# Altium project REG.PrjPcb (part 2 of 2)

## Sheet ALU_Shifter.SchDoc
size B; Author: E. Sims; Organization: Let's Build Rockets Inc.; SheetNumber: 15; SheetTotal: 16
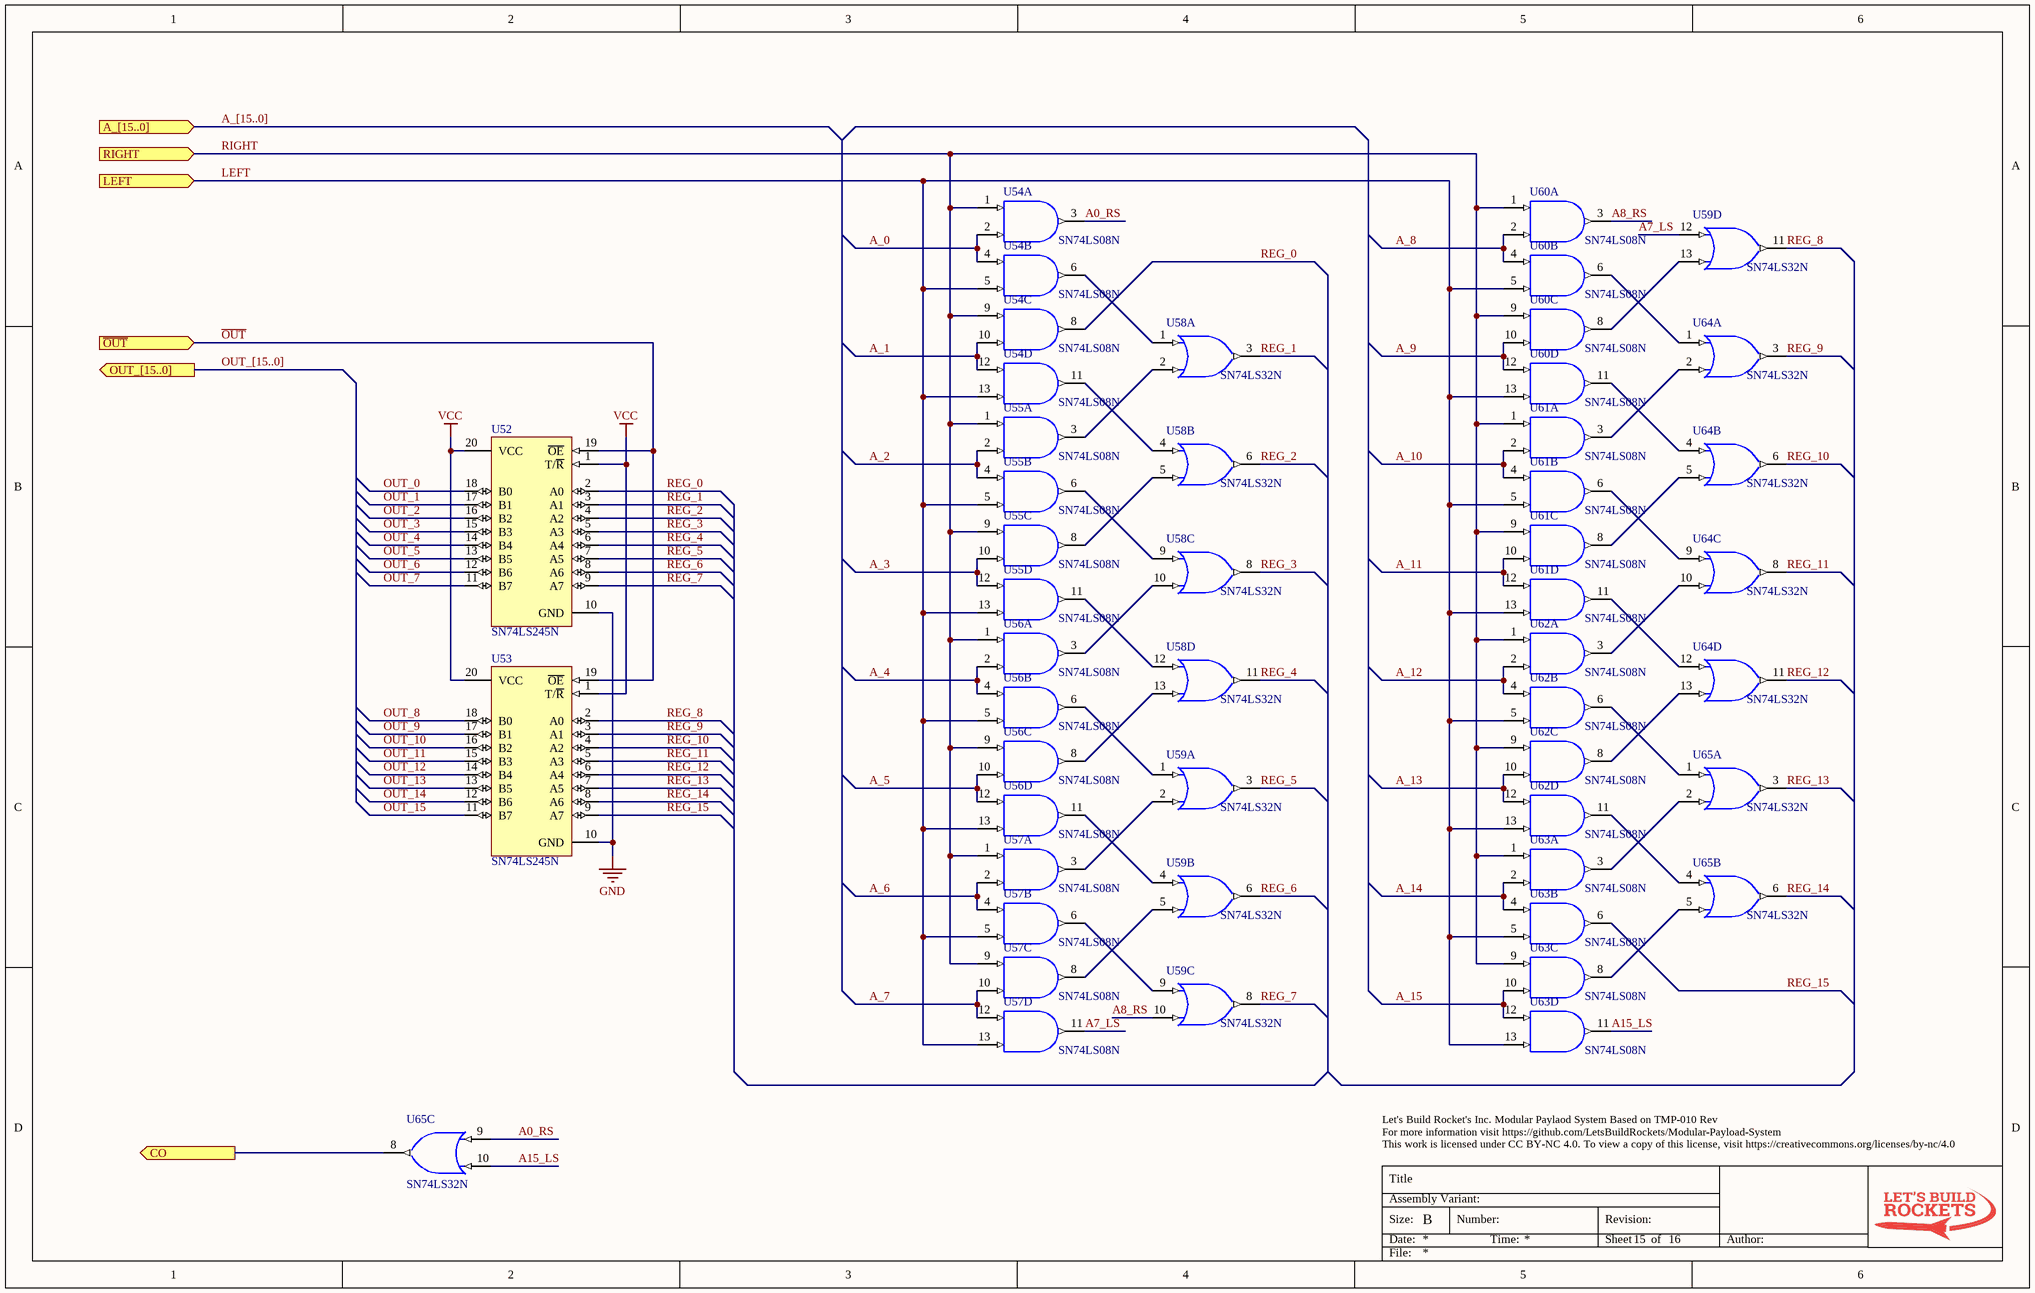
[diagram p11: ALU_Shifter.SchDoc]

### Parts
U52  SN74LS245N  [N020]
U53  SN74LS245N  [N020]
U54  SN74LS08N  [N014]  (parts A,B,C,D of 4)
U55  SN74LS08N  [N014]  (parts A,B,C,D of 4)
U56  SN74LS08N  [N014]  (parts A,B,C,D of 4)
U57  SN74LS08N  [N014]  (parts A,B,C,D of 4)
U58  SN74LS32N  [N014]  (parts A,B,C,D of 4)
U59  SN74LS32N  [N014]  (parts A,B,C,D of 4)
U60  SN74LS08N  [N014]  (parts A,B,C,D of 4)
U61  SN74LS08N  [N014]  (parts A,B,C,D of 4)
U62  SN74LS08N  [N014]  (parts A,B,C,D of 4)
U63  SN74LS08N  [N014]  (parts A,B,C,D of 4)
U64  SN74LS32N  [N014]  (parts A,B,C,D of 4)
U65  SN74LS32N  [N014]  (parts A,B,C of 4)

### Ports
A_[15..0] (in), CO (out), LEFT (in), OUT_[15..0] (out), RIGHT (in), ~{OUT} (in)

### Nets
GND: U52.10(GND) U53.10(GND) U54.7(GND) U55.7(GND) U56.7(GND) U57.7(GND) U58.7(GND) U59.7(GND) U60.7(GND) U61.7(GND) U62.7(GND) U63.7(GND) U64.7(GND) U65.7(GND)
VCC: U52.1(T/~{R}) U52.20(VCC) U53.1(T/~{R}) U53.20(VCC) U54.14(VCC) U55.14(VCC) U56.14(VCC) U57.14(VCC) U58.14(VCC) U59.14(VCC) U60.14(VCC) U61.14(VCC) U62.14(VCC) U63.14(VCC) U64.14(VCC) U65.14(VCC)
A0_RS: U54.3(Y) U65.9(A)
A7_LS: U57.11(Y) U59.12(A)
A8_RS: U59.10(B) U60.3(Y)
A15_LS: U63.11(Y) U65.10(B)
A_0: U54.2(B) U54.4(A)
A_1: U54.10(B) U54.12(A)
A_2: U55.2(B) U55.4(A)
A_3: U55.10(B) U55.12(A)
A_4: U56.2(B) U56.4(A)
A_5: U56.10(B) U56.12(A)
A_6: U57.2(B) U57.4(A)
A_7: U57.10(B) U57.12(A)
A_8: U60.2(B) U60.4(A)
A_9: U60.10(B) U60.12(A)
A_10: U61.2(B) U61.4(A)
A_11: U61.10(B) U61.12(A)
A_12: U62.2(B) U62.4(A)
A_13: U62.10(B) U62.12(A)
A_14: U63.2(B) U63.4(A)
A_15: U63.10(B) U63.12(A)
LEFT: U54.5(B) U54.13(B) U55.5(B) U55.13(B) U56.5(B) U56.13(B) U57.5(B) U57.13(B) U60.5(B) U60.13(B) U61.5(B) U61.13(B) U62.5(B) U62.13(B) U63.5(B) U63.13(B) ; port LEFT
~{OUT}: U52.19(~{OE}) U53.19(~{OE}) ; port ~{OUT}
OUT_0: U52.18(B0)  [project net BUS_0]
OUT_1: U52.17(B1)  [project net BUS_1]
OUT_2: U52.16(B2)  [project net BUS_2]
OUT_3: U52.15(B3)  [project net BUS_3]
OUT_4: U52.14(B4)  [project net BUS_4]
OUT_5: U52.13(B5)  [project net BUS_5]
OUT_6: U52.12(B6)  [project net BUS_6]
OUT_7: U52.11(B7)  [project net BUS_7]
OUT_8: U53.18(B0)  [project net BUS_8]
OUT_9: U53.17(B1)  [project net BUS_9]
OUT_10: U53.16(B2)  [project net BUS_10]
OUT_11: U53.15(B3)  [project net BUS_11]
OUT_12: U53.14(B4)  [project net BUS_12]
OUT_13: U53.13(B5)  [project net BUS_13]
OUT_14: U53.12(B6)  [project net BUS_14]
OUT_15: U53.11(B7)  [project net BUS_15]
REG_0: U52.2(A0) U54.8(Y)
REG_1: U52.3(A1) U58.3(Y)
REG_2: U52.4(A2) U58.6(Y)
REG_3: U52.5(A3) U58.8(Y)
REG_4: U52.6(A4) U58.11(Y)
REG_5: U52.7(A5) U59.3(Y)
REG_6: U52.8(A6) U59.6(Y)
REG_7: U52.9(A7) U59.8(Y)
REG_8: U53.2(A0) U59.11(Y)
REG_9: U53.3(A1) U64.3(Y)
REG_10: U53.4(A2) U64.6(Y)
REG_11: U53.5(A3) U64.8(Y)
REG_12: U53.6(A4) U64.11(Y)
REG_13: U53.7(A5) U65.3(Y)
REG_14: U53.8(A6) U65.6(Y)
REG_15: U53.9(A7) U63.6(Y)
RIGHT: U54.1(A) U54.9(A) U55.1(A) U55.9(A) U56.1(A) U56.9(A) U57.1(A) U57.9(A) U60.1(A) U60.9(A) U61.1(A) U61.9(A) U62.1(A) U62.9(A) U63.1(A) U63.9(A) ; port RIGHT
NetU54_6: U54.6(Y) U58.1(A)
NetU54_11: U54.11(Y) U58.4(A)
NetU55_3: U55.3(Y) U58.2(B)
NetU55_6: U55.6(Y) U58.9(A)
NetU55_8: U55.8(Y) U58.5(B)
NetU55_11: U55.11(Y) U58.12(A)
NetU56_3: U56.3(Y) U58.10(B)
NetU56_6: U56.6(Y) U59.1(A)
NetU56_8: U56.8(Y) U58.13(B)
NetU56_11: U56.11(Y) U59.4(A)
NetU57_3: U57.3(Y) U59.2(B)
NetU57_6: U57.6(Y) U59.9(A)
NetU57_8: U57.8(Y) U59.5(B)
NetU59_13: U59.13(B) U60.8(Y)
NetU60_6: U60.6(Y) U64.1(A)
NetU60_11: U60.11(Y) U64.4(A)
NetU61_3: U61.3(Y) U64.2(B)
NetU61_6: U61.6(Y) U64.9(A)
NetU61_8: U61.8(Y) U64.5(B)
NetU61_11: U61.11(Y) U64.12(A)
NetU62_3: U62.3(Y) U64.10(B)
NetU62_6: U62.6(Y) U65.1(A)
NetU62_8: U62.8(Y) U64.13(B)
NetU62_11: U62.11(Y) U65.4(A)
NetU63_3: U63.3(Y) U65.2(B)
NetU63_8: U63.8(Y) U65.5(B)
NetU65_8: U65.8(Y) ; port CO

### Buses and harness runs
bus A_[15..0] = port A_[15..0]
bus OUT_[15..0] = port OUT_[15..0]

### Notes on the sheet
- Let's Build Rocket's Inc. Modular Paylaod System Based on TMP-010 Rev
  For more information visit https://github.com/LetsBuildRockets/Modular-Payload-System
  This work is licensed under CC BY-NC 4.0. To view a copy of this license, visit https://creativecommons.org/licenses/by-nc/4.0
- Title
- Size:
- Date:
- Assembly Variant:
- B
- Number:
- Time:
- Revision:
- Sheet
- of
- Author:
- File:

### Library data of the parts
U52 U53 = SN74LS245N: Octal Bus Transceiver with 3-State Outputs; Published: 8-Jun-2000; LatestRevisionDate: 04-Mar-2005; LatestRevisionNote: Stylized 3D Model Added.; DatasheetVersion: Mar-1988; PackageVersion: Oct-1995; PackageReference: N020; Publisher: Altium Limited; PackageDescription: DIP; 20 Leads; Row Spacing 7.62 mm; Pitch 2.54 mm; ComponentLink1Description: Manufacturer Link; ComponentLink1URL: http://www.ti.com/; ComponentLink2Description: Datasheet; ComponentLink2URL: http://www-s.ti.com/sc/ds/sn74ls245.pdf
U54-U57 U60-U63 = SN74LS08N: Quadruple 2-Input Positive-AND Gate; Published: 8-Jun-2000; LatestRevisionDate: 04-Mar-2005; LatestRevisionNote: Stylized 3D Model Added.; DatasheetVersion: Mar-1988; PackageVersion: Oct-1995; PackageReference: N014; Publisher: Altium Limited; PackageDescription: DIP; 14 Leads; Row Spacing 7.62 mm; Pitch 2.54 mm; ComponentLink1Description: Manufacturer Link; ComponentLink1URL: http://www.ti.com/; ComponentLink2Description: Datasheet; ComponentLink2URL: http://www-s.ti.com/sc/ds/SN74LS08.pdf
U58 U59 U64 U65 = SN74LS32N: Quadruple 2-Input Positive-OR Gate; Published: 8-Jun-2000; LatestRevisionDate: 04-Mar-2005; LatestRevisionNote: Stylized 3D Model Added.; DatasheetVersion: Mar-1988; PackageVersion: Oct-1995; PackageReference: N014; Publisher: Altium Limited; PackageDescription: DIP; 14 Leads; Row Spacing 7.62 mm; Pitch 2.54 mm; ComponentLink1Description: Manufacturer Link; ComponentLink1URL: http://www.ti.com/; ComponentLink2Description: Datasheet; ComponentLink2URL: http://www-s.ti.com/sc/ds/sn74ls32.pdf

## Sheet ALU_ZF.SchDoc
size B; Author: E. Sims; Organization: Let's Build Rockets Inc.; SheetNumber: 16; SheetTotal: 16
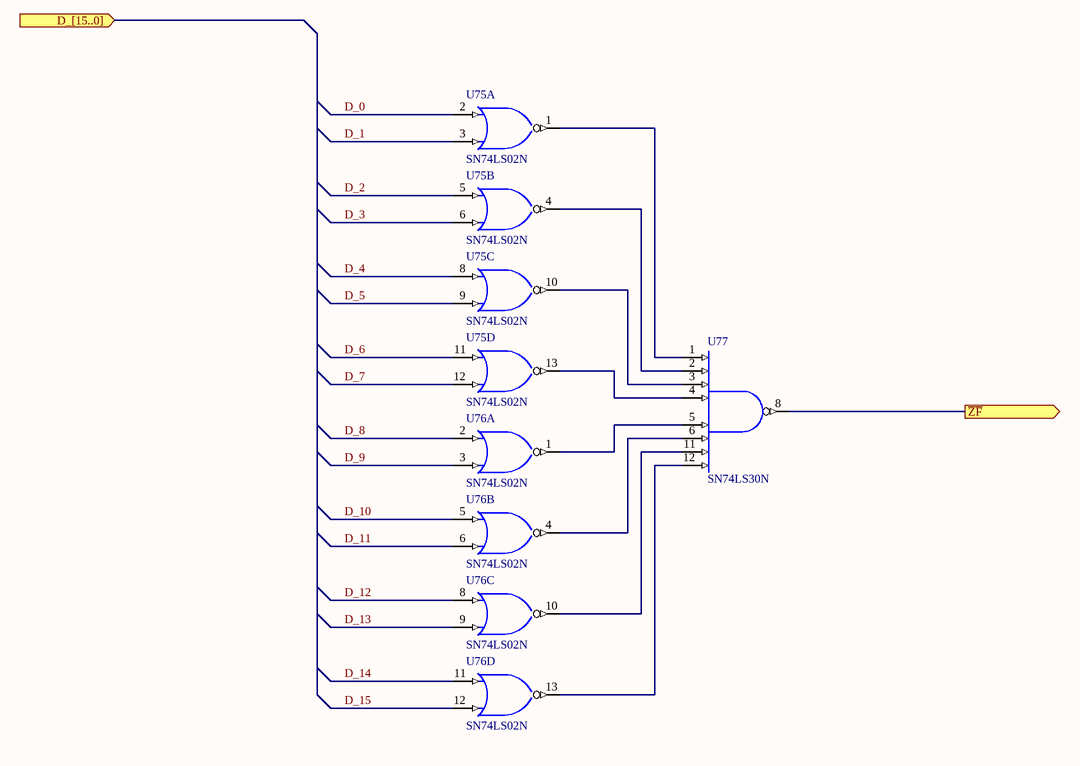
[diagram p12: ALU_ZF.SchDoc]

### Parts
U75  SN74LS02N  [N014]  (parts A,B,C,D of 4)
U76  SN74LS02N  [N014]  (parts A,B,C,D of 4)
U77  SN74LS30N  [N014]

### Ports
D_[15..0] (in), ~{ZF} (out)

### Nets
GND: U75.7(GND) U76.7(GND) U77.7(GND)
VCC: U75.14(VCC) U76.14(VCC) U77.14(VCC)
D_0: U75.2(A)
D_1: U75.3(B)
D_2: U75.5(A)
D_3: U75.6(B)
D_4: U75.8(A)
D_5: U75.9(B)
D_6: U75.11(A)
D_7: U75.12(B)
D_8: U76.2(A)
D_9: U76.3(B)
D_10: U76.5(A)
D_11: U76.6(B)
D_12: U76.8(A)
D_13: U76.9(B)
D_14: U76.11(A)
D_15: U76.12(B)
NetU25#2_1: U77.8(Y) ; port ~{ZF}
NetU75_1: U75.1(Y) U77.1(A)
NetU75_4: U75.4(Y) U77.2(B)
NetU75_10: U75.10(Y) U77.3(C)
NetU75_13: U75.13(Y) U77.4(D)
NetU76_1: U76.1(Y) U77.5(E)
NetU76_4: U76.4(Y) U77.6(F)
NetU76_10: U76.10(Y) U77.11(G)
NetU76_13: U76.13(Y) U77.12(H)

### Library data of the parts
U75 U76 = SN74LS02N: Quadruple 2-Input Positive-NOR Gate; Published: 8-Jun-2000; LatestRevisionDate: 04-Mar-2005; LatestRevisionNote: Stylized 3D Model Added.; DatasheetVersion: Mar-1988; PackageVersion: Oct-1995; PackageReference: N014; Publisher: Altium Limited; PackageDescription: DIP; 14 Leads; Row Spacing 7.62 mm; Pitch 2.54 mm; ComponentLink1Description: Manufacturer Link; ComponentLink1URL: http://www.ti.com/; ComponentLink2Description: Datasheet; ComponentLink2URL: http://www-s.ti.com/sc/ds/sn54s02.pdf
U77 = SN74LS30N: 8-Input Positive-NAND Gate; Note: Pins 9, 10  and 13 are NC & not drawn.; Published: 8-Jun-2000; LatestRevisionDate: 04-Mar-2005; LatestRevisionNote: Stylized 3D Model Added.; DatasheetVersion: Mar-1988; PackageVersion: Oct-1995; PackageReference: N014; Publisher: Altium Limited; PackageDescription: DIP; 14 Leads; Row Spacing 7.62 mm; Pitch 2.54 mm; ComponentLink1Description: Manufacturer Link; ComponentLink1URL: http://www.ti.com/; ComponentLink2Description: Datasheet; ComponentLink2URL: http://www-s.ti.com/sc/ds/sn74s30.pdf

## Sheet Output_Register.SchDoc
size B; Author: E. Sims; Organization: Let's Build Rockets Inc.; SheetNumber: 8; SheetTotal: 16
Used 2 times, as channels OUT_0, OUT_1. Parts and nets are listed once, with the designators drawn on the sheet.
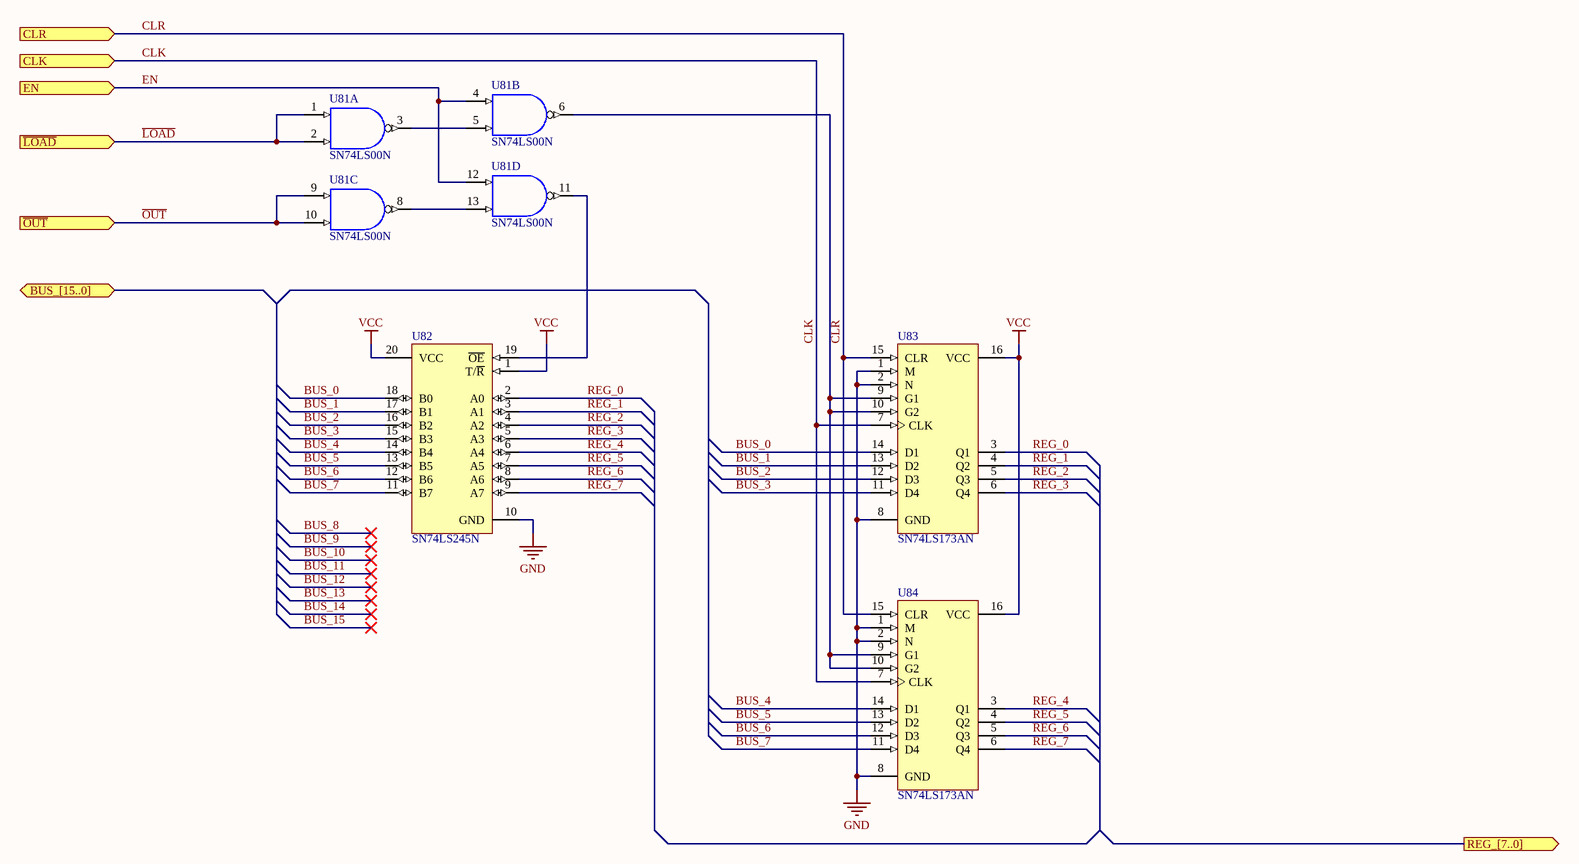
[diagram p13: Output_Register.SchDoc]

### Parts
U81  SN74LS00N  [N014]  (parts A,B,C,D of 4)
U82  SN74LS245N  [N020]
U83  SN74LS173AN  [N016D]
U84  SN74LS173AN  [N016D]

### Ports
BUS_[15..0] (bidir), CLK (in), CLR (in), EN (in), REG_[7..0] (out), ~{LOAD} (in), ~{OUT} (in)

### Nets
GND: U81.7(GND) U82.10(GND) U83.1(M) U83.2(N) U83.8(GND) U84.1(M) U84.2(N) U84.8(GND)
VCC: U81.14(VCC) U82.1(T/~{R}) U82.20(VCC) U83.16(VCC) U84.16(VCC)
BUS_0: U82.18(B0) U83.14(D1)
BUS_1: U82.17(B1) U83.13(D2)
BUS_2: U82.16(B2) U83.12(D3)
BUS_3: U82.15(B3) U83.11(D4)
BUS_4: U82.14(B4) U84.14(D1)
BUS_5: U82.13(B5) U84.13(D2)
BUS_6: U82.12(B6) U84.12(D3)
BUS_7: U82.11(B7) U84.11(D4)
CLK: U83.7(CLK) U84.7(CLK) ; port CLK
CLR: U83.15(CLR) U84.15(CLR) ; port CLR
EN: U81.4(A) U81.12(A) ; port EN
~{LOAD}: U81.1(A) U81.2(B) ; port ~{LOAD}
~{OUT}: U81.9(A) U81.10(B) ; port ~{OUT}
REG_0: U82.2(A0) U83.3(Q1)
REG_1: U82.3(A1) U83.4(Q2)
REG_2: U82.4(A2) U83.5(Q3)
REG_3: U82.5(A3) U83.6(Q4)
REG_4: U82.6(A4) U84.3(Q1)
REG_5: U82.7(A5) U84.4(Q2)
REG_6: U82.8(A6) U84.5(Q3)
REG_7: U82.9(A7) U84.6(Q4)
NetU81_3: U81.3(Y) U81.5(B)
NetU81_6: U81.6(Y) U83.9(G1) U83.10(G2) U84.9(G1) U84.10(G2)
NetU81_8: U81.8(Y) U81.13(B)
NetU81_11: U81.11(Y) U82.19(~{OE})

### Channels
OUT_0: designators end in _OUT_0; ports CLK=CLK CLR=CLR EN=EN ~{LOAD}=~{LOAD} ~{OUT}=~{MO}
OUT_1: designators end in _OUT_1; ports CLK=CLK CLR=CLR EN=EN ~{LOAD}=~{LOAD} ~{OUT}=~{MO}

### Notes on the sheet
- Let's Build Rocket's Inc. Modular Paylaod System Based on TMP-010 Rev
  For more information visit https://github.com/LetsBuildRockets/Modular-Payload-System
  This work is licensed under CC BY-NC 4.0. To view a copy of this license, visit https://creativecommons.org/licenses/by-nc/4.0
- Title
- Size:
- Date:
- Assembly Variant:
- B
- Number:
- Time:
- Revision:
- Sheet
- of
- Author:
- File:

### Library data of the parts
U81 = SN74LS00N: Quadruple 2-Input Positive-NAND Gate; Published: 8-Jun-2000; LatestRevisionDate: 04-Mar-2005; LatestRevisionNote: Stylized 3D Model Added.; DatasheetVersion: Mar-1988; PackageVersion: Oct-1995; PackageReference: N014; Publisher: Altium Limited; PackageDescription: DIP; 14 Leads; Row Spacing 7.62 mm; Pitch 2.54 mm; ComponentLink1Description: Manufacturer Link; ComponentLink1URL: http://www.ti.com/; ComponentLink2Description: Datasheet; ComponentLink2URL: http://www-s.ti.com/sc/ds/sn74ls00.pdf
U82 = SN74LS245N: as U52 on sheet ALU_Shifter; Published: 8-Jun-2000; LatestRevisionDate: 04-Mar-2005; LatestRevisionNote: Stylized 3D Model Added.; DatasheetVersion: Mar-1988; PackageVersion: Oct-1995; PackageReference: N020; Publisher: Altium Limited; PackageDescription: DIP; 20 Leads; Row Spacing 7.62 mm; Pitch 2.54 mm; ComponentLink1Description: Manufacturer Link; ComponentLink1URL: http://www.ti.com/; ComponentLink2Description: Datasheet; ComponentLink2URL: http://www-s.ti.com/sc/ds/sn74ls245.pdf
U83 U84 = SN74LS173AN: 4-Bit D-Type Register with 3-State Outputs; Published: 8-Jun-2000; LatestRevisionDate: 04-Mar-2005; LatestRevisionNote: Stylized 3D Model Added.; DatasheetVersion: Mar-1988; PackageVersion: Oct-1995; PackageReference: N016D; Publisher: Altium Limited; PackageDescription: DIP; 16 Leads; Row Spacing 7.62 mm; Pitch 2.54 mm; Code_JEDEC: MS-001-BB; ComponentLink1Description: Manufacturer Link; ComponentLink1URL: http://www.ti.com/; ComponentLink2Description: Datasheet; ComponentLink2URL: http://www-s.ti.com/sc/ds/sn74ls173a.pdf

## Sheet Instruction Register.SchDoc
size B; Author: E. Sims; Organization: Let's Build Rockets Inc.; SheetNumber: 7; SheetTotal: 17
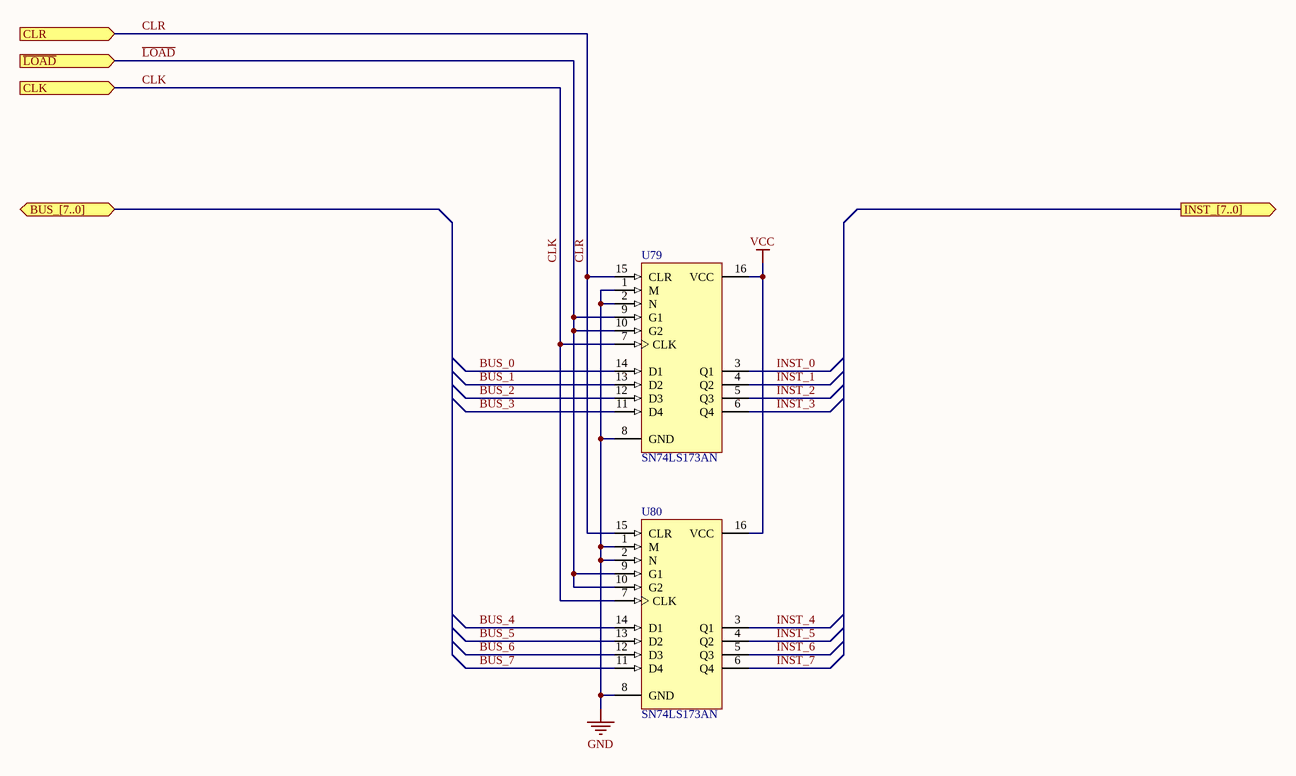
[diagram p14: Instruction Register.SchDoc]

### Parts
U79  SN74LS173AN  [N016D]
U80  SN74LS173AN  [N016D]

### Ports
BUS_[7..0] (bidir), CLK (in), CLR (in), INST_[7..0] (out), ~{LOAD} (in)

### Nets
GND: U79.1(M) U79.2(N) U79.8(GND) U80.1(M) U80.2(N) U80.8(GND)
VCC: U79.16(VCC) U80.16(VCC)
BUS_0: U79.14(D1)
BUS_1: U79.13(D2)
BUS_2: U79.12(D3)
BUS_3: U79.11(D4)
BUS_4: U80.14(D1)
BUS_5: U80.13(D2)
BUS_6: U80.12(D3)
BUS_7: U80.11(D4)
CLK: U79.7(CLK) U80.7(CLK) ; port CLK
CLR: U79.15(CLR) U80.15(CLR) ; port CLR
INST_0: U79.3(Q1)
INST_1: U79.4(Q2)
INST_2: U79.5(Q3)
INST_3: U79.6(Q4)
INST_4: U80.3(Q1)
INST_5: U80.4(Q2)
INST_6: U80.5(Q3)
INST_7: U80.6(Q4)
~{LOAD}: U79.9(G1) U79.10(G2) U80.9(G1) U80.10(G2) ; port ~{LOAD}  [project net ~{II}]

### Notes on the sheet
- Let's Build Rocket's Inc. Modular Paylaod System Based on TMP-010 Rev
  For more information visit https://github.com/LetsBuildRockets/Modular-Payload-System
  This work is licensed under CC BY-NC 4.0. To view a copy of this license, visit https://creativecommons.org/licenses/by-nc/4.0
- Title
- Size:
- Date:
- Assembly Variant:
- B
- Number:
- Time:
- Revision:
- Sheet
- of
- Author:
- File:

### Library data of the parts
U79 U80 = SN74LS173AN: as U83 on sheet Output_Register; Published: 8-Jun-2000; LatestRevisionDate: 04-Mar-2005; LatestRevisionNote: Stylized 3D Model Added.; DatasheetVersion: Mar-1988; PackageVersion: Oct-1995; PackageReference: N016D; Publisher: Altium Limited; PackageDescription: DIP; 16 Leads; Row Spacing 7.62 mm; Pitch 2.54 mm; Code_JEDEC: MS-001-BB; ComponentLink1Description: Manufacturer Link; ComponentLink1URL: http://www.ti.com/; ComponentLink2Description: Datasheet; ComponentLink2URL: http://www-s.ti.com/sc/ds/sn74ls173a.pdf

## Sheet Microcode.SchDoc
size B; Author: E. Sims; Organization: Let's Build Rockets Inc.; SheetNumber: 10; SheetTotal: 17
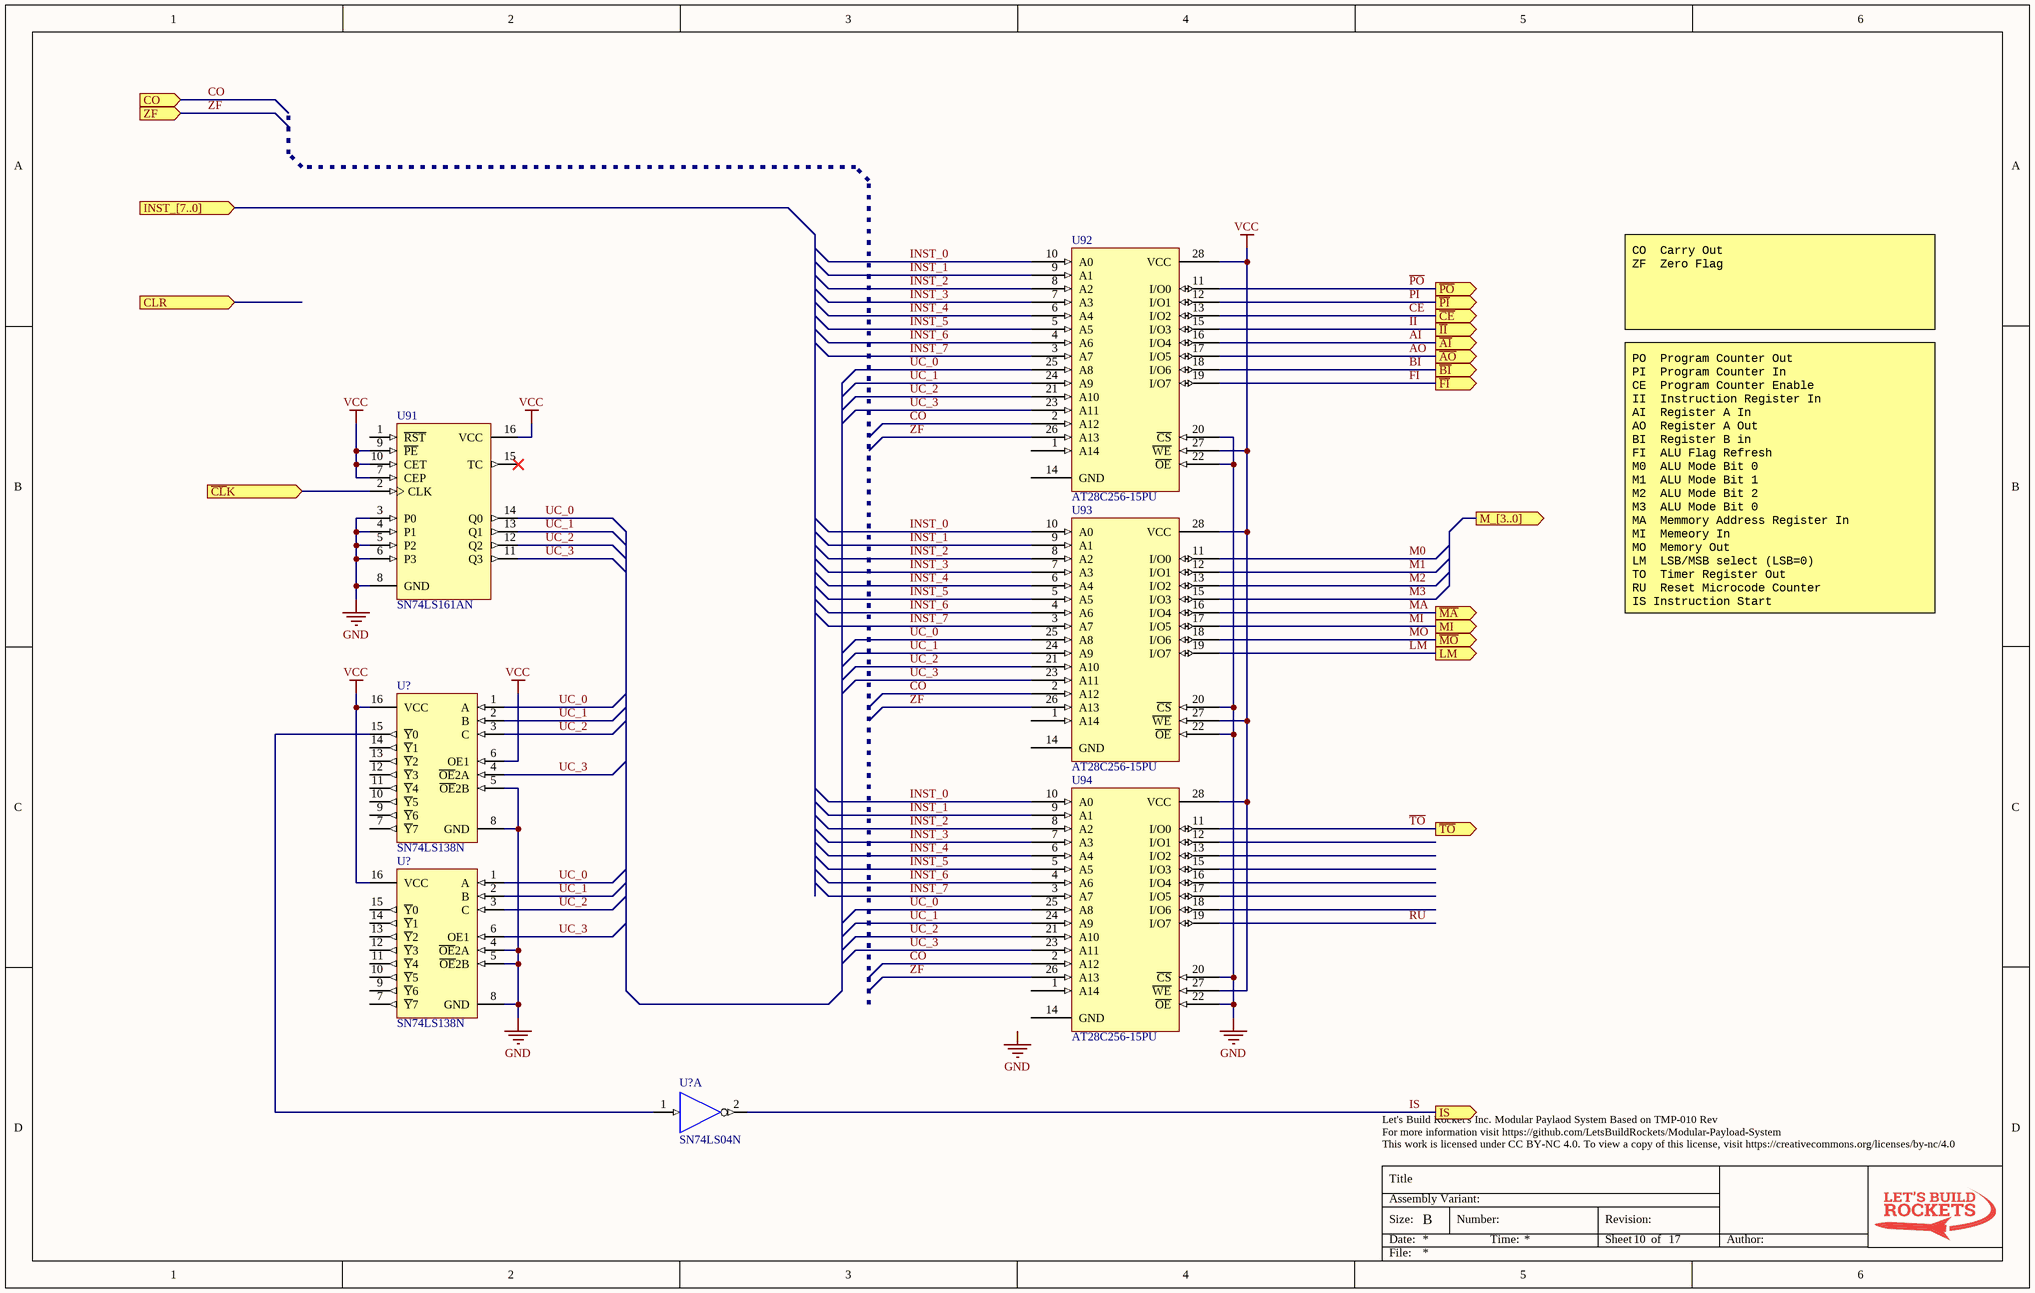
[diagram p15: Microcode.SchDoc]

### Parts
(Parts that share a designator on the sheet are numbered #1, #2 ... from top to bottom, then left to right.)
U91  SN74LS161AN  [N016]
U92  AT28C256-15PU  [J028]
U93  AT28C256-15PU  [J028]
U94  AT28C256-15PU  [J028]
U?#4  SN74LS138N  [N016]
U?#5  SN74LS138N  [N016]
U?#6  SN74LS04N  [N014]  (part A of 6)

### Ports
CLR (in), CO (in), INST_[7..0] (in), IS (out), LM (out), M_[3..0] (out), MI (out), ZF (in), ~{AI} (out), ~{AO} (out), ~{BI} (out), ~{CE} (out), ~{CL}K (in), ~{FI} (out), ~{II} (out), ~{MA} (out), ~{MO} (out), ~{PI} (out), ~{PO} (out), ~{TO} (out)

### Nets
GND: U91.3(P0) U91.4(P1) U91.5(P2) U91.6(P3) U91.8(GND) U92.20(~{CS}) U92.22(~{OE}) U93.20(~{CS}) U93.22(~{OE}) U94.20(~{CS}) U94.22(~{OE}) U?#4.5(~{OE}2B) U?#4.8(GND) U?#5.4(~{OE}2A) U?#5.5(~{OE}2B) U?#5.8(GND) U?#6.7(GND)
VCC: U91.7(CEP) U91.9(~{PE}) U91.10(CET) U91.16(VCC) U92.27(~{WE}) U92.28(VCC) U93.27(~{WE}) U93.28(VCC) U94.27(~{WE}) U94.28(VCC) U?#4.6(OE1) U?#4.16(VCC) U?#5.16(VCC) U?#6.14(VCC)
~{AI}: U92.16(I/O4) ; port ~{AI}
~{AO}: U92.17(I/O5) ; port ~{AO}
~{BI}: U92.18(I/O6) ; port ~{BI}
~{CE}: U92.13(I/O2) ; port ~{CE}
CO: U92.2(A12) U93.2(A12) U94.2(A12) ; port CO
~{FI}: U92.19(I/O7) ; port ~{FI}
~{II}: U92.15(I/O3) ; port ~{II}
INST_0: U92.10(A0) U93.10(A0) U94.10(A0)
INST_1: U92.9(A1) U93.9(A1) U94.9(A1)
INST_2: U92.8(A2) U93.8(A2) U94.8(A2)
INST_3: U92.7(A3) U93.7(A3) U94.7(A3)
INST_4: U92.6(A4) U93.6(A4) U94.6(A4)
INST_5: U92.5(A5) U93.5(A5) U94.5(A5)
INST_6: U92.4(A6) U93.4(A6) U94.4(A6)
INST_7: U92.3(A7) U93.3(A7) U94.3(A7)
IS: U?#6.2(Y) ; port IS
LM: U93.19(I/O7) ; port LM
M0: U93.11(I/O0)
M1: U93.12(I/O1)
M2: U93.13(I/O2)
M3: U93.15(I/O3)
~{MA}: U93.16(I/O4) ; port ~{MA}  [project net ~{LOAD}]
~{MO}: U93.18(I/O6) ; port ~{MO}
MI: U93.17(I/O5) ; port MI  [project net ~{LOAD}]
~{PI}: U92.12(I/O1) ; port ~{PI}  [project net ~{J}]
~{PO}: U92.11(I/O0) ; port ~{PO}  [project net ~{OUT}]
RU: U94.19(I/O7)
~{TO}: U94.11(I/O0) ; port ~{TO}  [project net ~{OUT}]
UC_0: U91.14(Q0) U92.25(A8) U93.25(A8) U94.25(A8) U?#4.1(A) U?#5.1(A)
UC_1: U91.13(Q1) U92.24(A9) U93.24(A9) U94.24(A9) U?#4.2(B) U?#5.2(B)
UC_2: U91.12(Q2) U92.21(A10) U93.21(A10) U94.21(A10) U?#4.3(C) U?#5.3(C)
UC_3: U91.11(Q3) U92.23(A11) U93.23(A11) U94.23(A11) U?#4.4(~{OE}2A) U?#5.6(OE1)
ZF: U92.26(A13) U93.26(A13) U94.26(A13) ; port ZF
NetU91_2: U91.2(CLK) ; port ~{CL}K
NetU?#4_15: U?#4.15(~{Y}0) U?#6.1(A)

Not connected (* = marked no-connect by the designer): U91 1(~{RST}) 15(TC)*; U92 1(A14) 14(GND); U93 1(A14) 14(GND); U94 1(A14) 12(I/O1) 13(I/O2) 14(GND) 15(I/O3) 16(I/O4) 17(I/O5) 18(I/O6); U?#4 7(~{Y}7) 9(~{Y}6) 10(~{Y}5) 11(~{Y}4) 12(~{Y}3) 13(~{Y}2) 14(~{Y}1); U?#5 7(~{Y}7) 9(~{Y}6) 10(~{Y}5) 11(~{Y}4) 12(~{Y}3) 13(~{Y}2) 14(~{Y}1) 15(~{Y}0)

### Notes on the sheet
- CO  Carry Out
  ZF  Zero Flag
- PO  Program Counter Out
  PI  Program Counter In
  CE  Program Counter Enable
  II  Instruction Register In
  AI  Register A In
  AO  Register A Out
  BI  Register B in
  FI  ALU Flag Refresh
  M0  ALU Mode Bit 0
  M1  ALU Mode Bit 1
  M2  ALU Mode Bit 2
  M3  ALU Mode Bit 0
  MA  Memmory Address Register In
  MI  Memeory In
  MO  Memory Out
  LM  LSB/MSB select (LSB=0)
  TO  Timer Register Out
  RU  Reset Microcode Counter
  IS Instruction Start
- Labels drawn without touching a wire or pin: GND
- Let's Build Rocket's Inc. Modular Paylaod System Based on TMP-010 Rev
  For more information visit https://github.com/LetsBuildRockets/Modular-Payload-System
  This work is licensed under CC BY-NC 4.0. To view a copy of this license, visit https://creativecommons.org/licenses/by-nc/4.0
- Title
- Size:
- Date:
- Assembly Variant:
- B
- Number:
- Time:
- Revision:
- Sheet
- of
- Author:
- File:

### Library data of the parts
U91 = SN74LS161AN: Synchronous 4-Bit Counter; Published: 8-Jun-2000; LatestRevisionDate: 04-Mar-2005; LatestRevisionNote: Stylized 3D Model Added.; DatasheetVersion: Mar-1988; PackageVersion: Oct-1995; PackageReference: N016; Publisher: Altium Limited; PackageDescription: DIP; 16 Leads; Row Spacing 7.62 mm; Pitch 2.54 mm; Code_JEDEC: MS-001-BB; ComponentLink1Description: Manufacturer Link; ComponentLink1URL: http://www.ti.com/; ComponentLink2Description: Datasheet; ComponentLink2URL: http://www-s.ti.com/sc/ds/sn74ls161a.pdf; ComponentLink3Description: URL Link1; ComponentLink3URL: http://focus.ti.com/docs/prod/folders/print/sn74ls161a.html
U?#4 U?#5 = SN74LS138N: 3-Line to 8-Line Decoder / Demultiplexer; Published: 8-Jun-2000; LatestRevisionDate: 04-Mar-2005; LatestRevisionNote: Stylized 3D Model Added.; DatasheetVersion: Mar-1988; PackageVersion: Oct-1995; PackageReference: N016; Publisher: Altium Limited; PackageDescription: DIP; 16 Leads; Row Spacing 7.62 mm; Pitch 2.54 mm; Code_JEDEC: MS-001-BB; ComponentLink1Description: Manufacturer Link; ComponentLink1URL: http://www.ti.com/; ComponentLink2Description: Datasheet; ComponentLink2URL: http://www-s.ti.com/sc/ds/sn74ls138.pdf
U?#6 = SN74LS04N: Hex Inverter; Published: 8-Jun-2000; LatestRevisionDate: 04-Mar-2005; LatestRevisionNote: Stylized 3D Model Added.; DatasheetVersion: Mar-1988; PackageVersion: Oct-1995; PackageReference: N014; Publisher: Altium Limited; PackageDescription: DIP; 14 Leads; Row Spacing 7.62 mm; Pitch 2.54 mm; ComponentLink1Description: Manufacturer Link; ComponentLink1URL: http://www.ti.com/; ComponentLink2Description: Datasheet; ComponentLink2URL: http://www-s.ti.com/sc/ds/sn74ls04.pdf

## Sheet Timer_Register.SchDoc
size B; Author: E. Sims; Organization: Let's Build Rockets Inc.; SheetNumber: 9; SheetTotal: 16
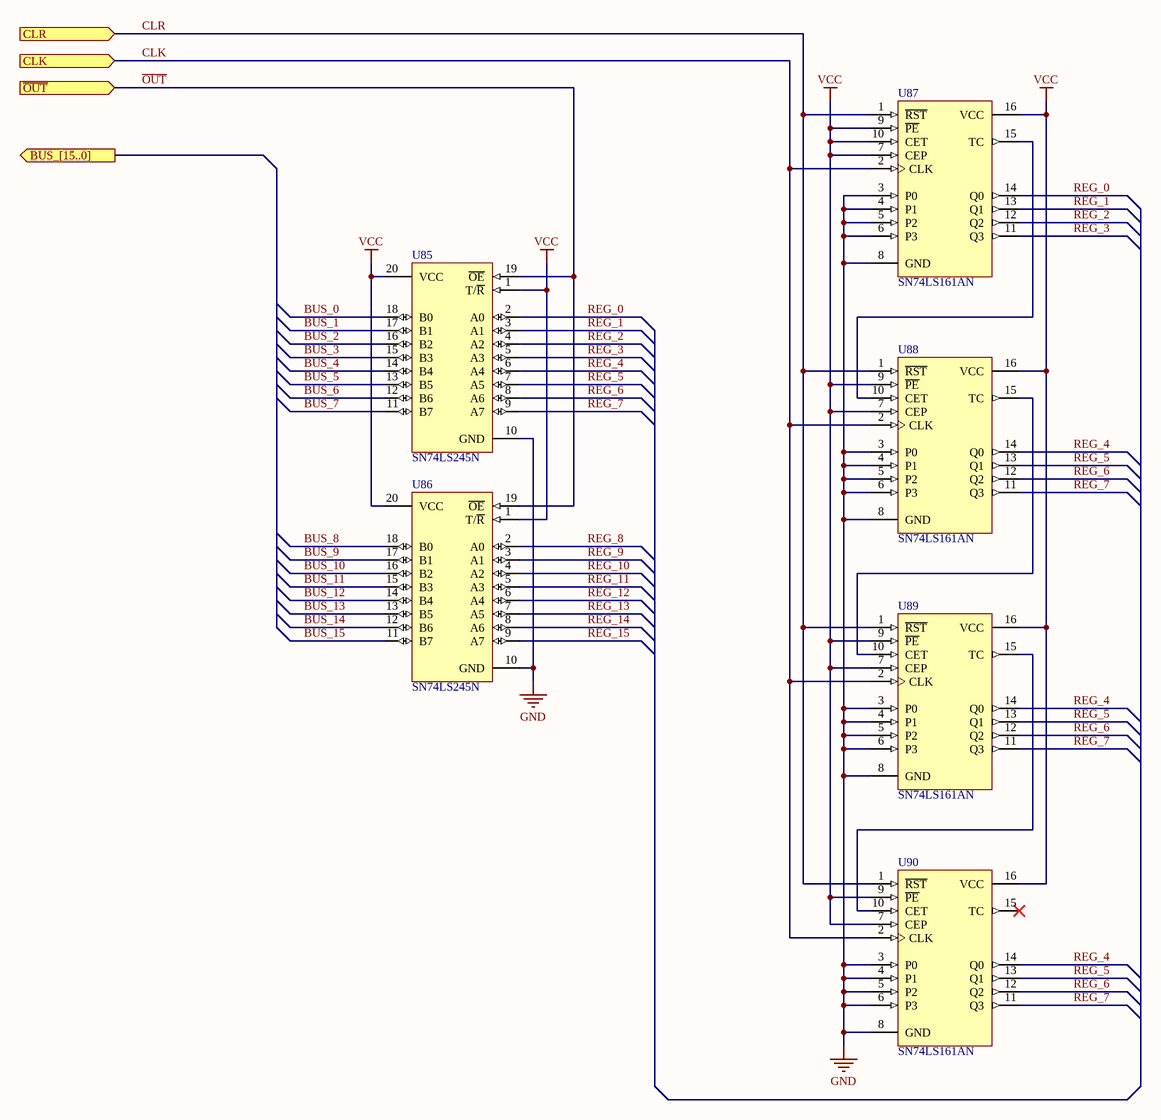
[diagram p16: Timer_Register.SchDoc]

### Parts
U85  SN74LS245N  [N020]
U86  SN74LS245N  [N020]
U87  SN74LS161AN  [N016]
U88  SN74LS161AN  [N016]
U89  SN74LS161AN  [N016]
U90  SN74LS161AN  [N016]

### Ports
BUS_[15..0] (out), CLK (in), CLR (in), ~{OUT} (in)

### Nets
GND: U85.10(GND) U86.10(GND) U87.3(P0) U87.4(P1) U87.5(P2) U87.6(P3) U87.8(GND) U88.3(P0) U88.4(P1) U88.5(P2) U88.6(P3) U88.8(GND) U89.3(P0) U89.4(P1) U89.5(P2) U89.6(P3) U89.8(GND) U90.3(P0) U90.4(P1) U90.5(P2) U90.6(P3) U90.8(GND)
VCC: U85.1(T/~{R}) U85.20(VCC) U86.1(T/~{R}) U86.20(VCC) U87.7(CEP) U87.9(~{PE}) U87.10(CET) U87.16(VCC) U88.7(CEP) U88.9(~{PE}) U88.16(VCC) U89.7(CEP) U89.9(~{PE}) U89.16(VCC) U90.7(CEP) U90.9(~{PE}) U90.16(VCC)
BUS_0: U85.18(B0)
BUS_1: U85.17(B1)
BUS_2: U85.16(B2)
BUS_3: U85.15(B3)
BUS_4: U85.14(B4)
BUS_5: U85.13(B5)
BUS_6: U85.12(B6)
BUS_7: U85.11(B7)
BUS_8: U86.18(B0)
BUS_9: U86.17(B1)
BUS_10: U86.16(B2)
BUS_11: U86.15(B3)
BUS_12: U86.14(B4)
BUS_13: U86.13(B5)
BUS_14: U86.12(B6)
BUS_15: U86.11(B7)
CLK: U87.2(CLK) U88.2(CLK) U89.2(CLK) U90.2(CLK) ; port CLK
CLR: U87.1(~{RST}) U88.1(~{RST}) U89.1(~{RST}) U90.1(~{RST}) ; port CLR
~{OUT}: U85.19(~{OE}) U86.19(~{OE}) ; port ~{OUT}
REG_0: U85.2(A0) U87.14(Q0)
REG_1: U85.3(A1) U87.13(Q1)
REG_2: U85.4(A2) U87.12(Q2)
REG_3: U85.5(A3) U87.11(Q3)
REG_4: U85.6(A4) U88.14(Q0) U89.14(Q0) U90.14(Q0)
REG_5: U85.7(A5) U88.13(Q1) U89.13(Q1) U90.13(Q1)
REG_6: U85.8(A6) U88.12(Q2) U89.12(Q2) U90.12(Q2)
REG_7: U85.9(A7) U88.11(Q3) U89.11(Q3) U90.11(Q3)
REG_8: U86.2(A0)
REG_9: U86.3(A1)
REG_10: U86.4(A2)
REG_11: U86.5(A3)
REG_12: U86.6(A4)
REG_13: U86.7(A5)
REG_14: U86.8(A6)
REG_15: U86.9(A7)
NetU87_15: U87.15(TC) U88.10(CET)
NetU88_15: U88.15(TC) U89.10(CET)
NetU89_15: U89.15(TC) U90.10(CET)

Not connected (* = marked no-connect by the designer): U90 15(TC)*

### Notes on the sheet
- Let's Build Rocket's Inc. Modular Paylaod System Based on TMP-010 Rev
  For more information visit https://github.com/LetsBuildRockets/Modular-Payload-System
  This work is licensed under CC BY-NC 4.0. To view a copy of this license, visit https://creativecommons.org/licenses/by-nc/4.0
- Title
- Size:
- Date:
- Assembly Variant:
- B
- Number:
- Time:
- Revision:
- Sheet
- of
- Author:
- File:

### Library data of the parts
U85 U86 = SN74LS245N: as U52 on sheet ALU_Shifter; Published: 8-Jun-2000; LatestRevisionDate: 04-Mar-2005; LatestRevisionNote: Stylized 3D Model Added.; DatasheetVersion: Mar-1988; PackageVersion: Oct-1995; PackageReference: N020; Publisher: Altium Limited; PackageDescription: DIP; 20 Leads; Row Spacing 7.62 mm; Pitch 2.54 mm; ComponentLink1Description: Manufacturer Link; ComponentLink1URL: http://www.ti.com/; ComponentLink2Description: Datasheet; ComponentLink2URL: http://www-s.ti.com/sc/ds/sn74ls245.pdf
U87-U90 = SN74LS161AN: Synchronous 4-Bit Counter; Published: 8-Jun-2000; LatestRevisionDate: 04-Mar-2005; LatestRevisionNote: Stylized 3D Model Added.; DatasheetVersion: Mar-1988; PackageVersion: Oct-1995; PackageReference: N016; Publisher: Altium Limited; PackageDescription: DIP; 16 Leads; Row Spacing 7.62 mm; Pitch 2.54 mm; Code_JEDEC: MS-001-BB; ComponentLink1Description: Manufacturer Link; ComponentLink1URL: http://www.ti.com/; ComponentLink2Description: Datasheet; ComponentLink2URL: http://www-s.ti.com/sc/ds/sn74ls161a.pdf; ComponentLink3Description: URL Link1; ComponentLink3URL: http://focus.ti.com/docs/prod/folders/print/sn74ls161a.html

## Nets that join several sheets
GND: REG_A (14 pins), REG_B (14 pins), Program_Counter (6 pins), Memory_Address_Register (17 pins), Memory_SRAM (11 pins), Memory_EEPROM (7 pins), ALU (11 pins), ALU_Adder (6 pins), ALU_AND (6 pins), ALU_OR (6 pins), ALU_XOR (6 pins), ALU_Shifter (14 pins), ALU_ZF (U75.7 U76.7 U77.7), OUT_0 (8 pins), Instruction Register (6 pins), Microcode (17 pins), Timer_Register (22 pins), OUT_1 (8 pins)
VCC: REG_A (8 pins), REG_B (8 pins), Program_Counter (8 pins), Memory_Address_Register (7 pins), Memory_SRAM (7 pins), Memory_EEPROM (7 pins), ALU (7 pins), ALU_Adder (8 pins), ALU_AND (8 pins), ALU_OR (8 pins), ALU_XOR (8 pins), ALU_Shifter (16 pins), ALU_ZF (U75.14 U76.14 U77.14), OUT_0 (5 pins), Instruction Register (U79.16 U80.16), Microcode (14 pins), Timer_Register (17 pins), OUT_1 (5 pins)
~{ADD_OUT}: ALU (U25#1.6), ALU_Adder (U27.19 U28.19)
~{AI}: REG_A (8 pins), Microcode (U92.16)
~{AND}: ALU (U23.12), ALU_AND (U33.19 U34.19)
~{AO}: REG_A (U17_REG_A.19 U18_REG_A.19), Microcode (U92.17)
A_0: ALU_Adder (U29.5), ALU_AND (U35.1), ALU_OR (U41.1), ALU_XOR (U47.1), ALU_Shifter (U54.2 U54.4)
A_1: ALU_Adder (U29.3), ALU_AND (U35.4), ALU_OR (U41.4), ALU_XOR (U47.4), ALU_Shifter (U54.10 U54.12)
A_2: ALU_Adder (U29.14), ALU_AND (U35.9), ALU_OR (U41.9), ALU_XOR (U47.9), ALU_Shifter (U55.2 U55.4)
A_3: ALU_Adder (U29.12), ALU_AND (U35.12), ALU_OR (U41.12), ALU_XOR (U47.12), ALU_Shifter (U55.10 U55.12)
A_4: ALU_Adder (U30.5), ALU_AND (U36.1), ALU_OR (U42.1), ALU_XOR (U48.1), ALU_Shifter (U56.2 U56.4)
A_5: ALU_Adder (U30.3), ALU_AND (U36.4), ALU_OR (U42.4), ALU_XOR (U48.4), ALU_Shifter (U56.10 U56.12)
A_6: ALU_Adder (U30.14), ALU_AND (U36.9), ALU_OR (U42.9), ALU_XOR (U48.9), ALU_Shifter (U57.2 U57.4)
A_7: ALU_Adder (U30.12), ALU_AND (U36.12), ALU_OR (U42.12), ALU_XOR (U48.12), ALU_Shifter (U57.10 U57.12)
A_8: ALU_Adder (U31.5), ALU_AND (U37.1), ALU_OR (U43.1), ALU_XOR (U49.1), ALU_Shifter (U60.2 U60.4)
A_9: ALU_Adder (U31.3), ALU_AND (U37.4), ALU_OR (U43.4), ALU_XOR (U49.4), ALU_Shifter (U60.10 U60.12)
A_10: ALU_Adder (U31.14), ALU_AND (U37.9), ALU_OR (U43.9), ALU_XOR (U49.9), ALU_Shifter (U61.2 U61.4)
A_11: ALU_Adder (U31.12), ALU_AND (U37.12), ALU_OR (U43.12), ALU_XOR (U49.12), ALU_Shifter (U61.10 U61.12)
A_12: ALU_Adder (U32.5), ALU_AND (U38.1), ALU_OR (U44.1), ALU_XOR (U50.1), ALU_Shifter (U62.2 U62.4)
A_13: ALU_Adder (U32.3), ALU_AND (U38.4), ALU_OR (U44.4), ALU_XOR (U50.4), ALU_Shifter (U62.10 U62.12)
A_14: ALU_Adder (U32.14), ALU_AND (U38.9), ALU_OR (U44.9), ALU_XOR (U50.9), ALU_Shifter (U63.2 U63.4)
A_15: ALU_Adder (U32.12), ALU_AND (U38.12), ALU_OR (U44.12), ALU_XOR (U50.12), ALU_Shifter (U63.10 U63.12)
~{BI}: REG_B (8 pins), Microcode (U92.18)
B_0: ALU_Adder (U29.6), ALU_AND (U35.2), ALU_OR (U41.2), ALU_XOR (U47.2)
B_1: ALU_Adder (U29.2), ALU_AND (U35.5), ALU_OR (U41.5), ALU_XOR (U47.5)
B_2: ALU_Adder (U29.15), ALU_AND (U35.10), ALU_OR (U41.10), ALU_XOR (U47.10)
B_3: ALU_Adder (U29.11), ALU_AND (U35.13), ALU_OR (U41.13), ALU_XOR (U47.13)
B_4: ALU_Adder (U30.6), ALU_AND (U36.2), ALU_OR (U42.2), ALU_XOR (U48.2)
B_5: ALU_Adder (U30.2), ALU_AND (U36.5), ALU_OR (U42.5), ALU_XOR (U48.5)
B_6: ALU_Adder (U30.15), ALU_AND (U36.10), ALU_OR (U42.10), ALU_XOR (U48.10)
B_7: ALU_Adder (U30.11), ALU_AND (U36.13), ALU_OR (U42.13), ALU_XOR (U48.13)
B_8: ALU_Adder (U31.6), ALU_AND (U37.2), ALU_OR (U43.2), ALU_XOR (U49.2)
B_9: ALU_Adder (U31.2), ALU_AND (U37.5), ALU_OR (U43.5), ALU_XOR (U49.5)
B_10: ALU_Adder (U31.15), ALU_AND (U37.10), ALU_OR (U43.10), ALU_XOR (U49.10)
B_11: ALU_Adder (U31.11), ALU_AND (U37.13), ALU_OR (U43.13), ALU_XOR (U49.13)
B_12: ALU_Adder (U32.6), ALU_AND (U38.2), ALU_OR (U44.2), ALU_XOR (U50.2)
B_13: ALU_Adder (U32.2), ALU_AND (U38.5), ALU_OR (U44.5), ALU_XOR (U50.5)
B_14: ALU_Adder (U32.15), ALU_AND (U38.10), ALU_OR (U44.10), ALU_XOR (U50.10)
B_15: ALU_Adder (U32.11), ALU_AND (U38.13), ALU_OR (U44.13), ALU_XOR (U50.13)
BUS_0: ALU_Adder (U27.18), ALU_AND (U33.18), ALU_OR (U39.18), ALU_XOR (U45.18), ALU_Shifter (U52.18)
BUS_1: ALU_Adder (U27.17), ALU_AND (U33.17), ALU_OR (U39.17), ALU_XOR (U45.17), ALU_Shifter (U52.17)
BUS_2: ALU_Adder (U27.16), ALU_AND (U33.16), ALU_OR (U39.16), ALU_XOR (U45.16), ALU_Shifter (U52.16)
BUS_3: ALU_Adder (U27.15), ALU_AND (U33.15), ALU_OR (U39.15), ALU_XOR (U45.15), ALU_Shifter (U52.15)
BUS_4: ALU_Adder (U27.14), ALU_AND (U33.14), ALU_OR (U39.14), ALU_XOR (U45.14), ALU_Shifter (U52.14)
BUS_5: ALU_Adder (U27.13), ALU_AND (U33.13), ALU_OR (U39.13), ALU_XOR (U45.13), ALU_Shifter (U52.13)
BUS_6: ALU_Adder (U27.12), ALU_AND (U33.12), ALU_OR (U39.12), ALU_XOR (U45.12), ALU_Shifter (U52.12)
BUS_7: ALU_Adder (U27.11), ALU_AND (U33.11), ALU_OR (U39.11), ALU_XOR (U45.11), ALU_Shifter (U52.11)
BUS_8: ALU_Adder (U28.18), ALU_AND (U34.18), ALU_OR (U40.18), ALU_XOR (U46.18), ALU_Shifter (U53.18)
BUS_9: ALU_Adder (U28.17), ALU_AND (U34.17), ALU_OR (U40.17), ALU_XOR (U46.17), ALU_Shifter (U53.17)
BUS_10: ALU_Adder (U28.16), ALU_AND (U34.16), ALU_OR (U40.16), ALU_XOR (U46.16), ALU_Shifter (U53.16)
BUS_11: ALU_Adder (U28.15), ALU_AND (U34.15), ALU_OR (U40.15), ALU_XOR (U46.15), ALU_Shifter (U53.15)
BUS_12: ALU_Adder (U28.14), ALU_AND (U34.14), ALU_OR (U40.14), ALU_XOR (U46.14), ALU_Shifter (U53.14)
BUS_13: ALU_Adder (U28.13), ALU_AND (U34.13), ALU_OR (U40.13), ALU_XOR (U46.13), ALU_Shifter (U53.13)
BUS_14: ALU_Adder (U28.12), ALU_AND (U34.12), ALU_OR (U40.12), ALU_XOR (U46.12), ALU_Shifter (U53.12)
BUS_15: ALU_Adder (U28.11), ALU_AND (U34.11), ALU_OR (U40.11), ALU_XOR (U46.11), ALU_Shifter (U53.11)
~{CE}: Program_Counter (5 pins), Microcode (U92.13)
CLK: REG_A (U19_REG_A.7 U20_REG_A.7 U21_REG_A.7 U22_REG_A.7), REG_B (U19_REG_B.7 U20_REG_B.7 U21_REG_B.7 U22_REG_B.7), Program_Counter (U3.2 U4.2 U5.2 U6.2), Memory_Address_Register (U7.7 U8.7 U9.7 U10.7), Memory_SRAM (U11.11), Memory_EEPROM (U67.5), ALU (U78.7), OUT_0 (U83_OUT_0.7 U84_OUT_0.7), Instruction Register (U79.7 U80.7), OUT_1 (U83_OUT_1.7 U84_OUT_1.7)
CLR: REG_A (U19_REG_A.15 U20_REG_A.15 U21_REG_A.15 U22_REG_A.15), REG_B (U19_REG_B.15 U20_REG_B.15 U21_REG_B.15 U22_REG_B.15), Program_Counter (U3.1 U4.1 U5.1 U6.1), Memory_Address_Register (U7.15 U8.15 U9.15 U10.15), ALU (U78.15), OUT_0 (U83_OUT_0.15 U84_OUT_0.15), Instruction Register (U79.15 U80.15), Timer_Register (U87.1 U88.1 U89.1 U90.1), OUT_1 (U83_OUT_1.15 U84_OUT_1.15)
CO: ALU (U78.3), Microcode (U92.2 U93.2 U94.2)
EN: Memory_Address_Register (U72.2), Memory_EEPROM (U68.1)
EN: Memory_Address_Register (U73.3), Memory_SRAM (U?#1.5)
EN: Memory_Address_Register (U72.6), OUT_0 (U81_OUT_0.4 U81_OUT_0.12)
EN: Memory_Address_Register (U72.8), OUT_1 (U81_OUT_1.4 U81_OUT_1.12)
~{FI}: ALU (U78.9 U78.10), Microcode (U92.19)
~{II}: Instruction Register (U79.9 U79.10 U80.9 U80.10), Microcode (U92.15)
~{J}: Program_Counter (U3.9 U4.9 U5.9 U6.9), Microcode (U92.12)
~{LOAD}: Memory_Address_Register (8 pins), Microcode (U93.16)
~{LOAD}: Memory_SRAM (U?#1.4), OUT_0 (U81_OUT_0.1 U81_OUT_0.2), Microcode (U93.17), OUT_1 (U81_OUT_1.1 U81_OUT_1.2)
LEFT: ALU (U25#1.8 U26.4), ALU_Shifter (16 pins)
LM: Memory_EEPROM (U67.3 U68.5), Microcode (U93.19)
~{MO}: Memory_SRAM (U?#2.19), Memory_EEPROM (U67.1), OUT_0 (U81_OUT_0.9 U81_OUT_0.10), Microcode (U93.18), OUT_1 (U81_OUT_1.9 U81_OUT_1.10)
NetU25#2_1: ALU (U25#2.1), ALU_ZF (U77.8)
~{OR}: ALU (U23.11), ALU_OR (U39.19 U40.19)
~{OUT}: Program_Counter (U1.19 U2.19), Microcode (U92.11)
~{OUT}: ALU (U23.10), ALU_XOR (U45.19 U46.19)
~{OUT}: ALU (U25#1.12), ALU_Shifter (U52.19 U53.19)
~{OUT}: Microcode (U94.11), Timer_Register (U85.19 U86.19)
RIGHT: ALU (U25#1.10 U26.5), ALU_Shifter (16 pins)
SUB: ALU (U25#1.4 U26.2), ALU_Adder (U29.7)
ZF: ALU (U78.4), Microcode (U92.26 U93.26 U94.26)